# Altium project Baja_PDU.PrjPcb
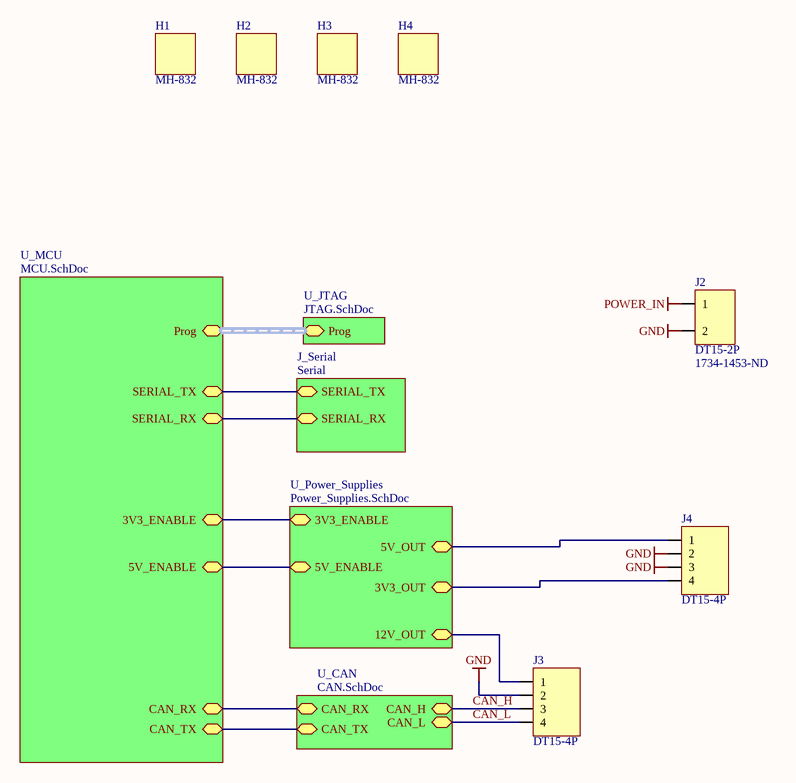
[diagram p0: Baja_PDU_004.SchDoc]
6 sheets, 96 parts. Net scope: hierarchical (ports join the sheet entries above them; power ports are global).
Board file: Baja_PDU_004.PcbDoc
Sheets:
  Baja_PDU_004.SchDoc
    U_JTAG = JTAG.SchDoc
    U_MCU = MCU.SchDoc
    U_Power_Supplies = Power_Supplies.SchDoc
    U_CAN = CAN.SchDoc
    J_Serial = Serial.SchDoc

## Sheet Baja_PDU_004.SchDoc
size Tabloid

### Parts
H1  MH-832  [MH-832]
H2  MH-832  [MH-832]
H3  MH-832  [MH-832]
H4  MH-832  [MH-832]
J2  DT15-2P  Supplier Part Number 1: 1734-1453-ND  [Connector-DT15-2P]
J3  DT15-4P  [DT15-4P]
J4  DT15-4P  [DT15-4P]

### Sub-sheets
J_Serial = Serial: SERIAL_RX, SERIAL_TX
U_CAN = CAN.SchDoc: CAN_H (bidir), CAN_L (bidir), CAN_RX (bidir), CAN_TX (bidir)
U_JTAG = JTAG.SchDoc: Prog (harness Prog)
U_MCU = MCU.SchDoc: Prog (harness Prog), CAN_TX (bidir), CAN_RX (bidir), 5V_ENABLE (bidir), SERIAL_TX, SERIAL_RX, 3V3_ENABLE
U_Power_Supplies = Power_Supplies.SchDoc: 5V_ENABLE (bidir), 3V3_ENABLE, 3V3_OUT, 5V_OUT, 12V_OUT

### Nets
GND: J2.2 J3.2 J4.2 J4.3
POWER_IN: J2.1
3V3-Enable: sheet U_MCU/3V3_ENABLE, sheet U_Power_Supplies/3V3_ENABLE
5V-ENABLE: sheet U_MCU/5V_ENABLE, sheet U_Power_Supplies/5V_ENABLE
CAN0RX: sheet U_MCU/CAN_RX, sheet U_CAN/CAN_RX
CAN0TX: sheet U_MCU/CAN_TX, sheet U_CAN/CAN_TX
CAN_H: J3.3 ; sheet U_CAN/CAN_H
CAN_L: J3.4 ; sheet U_CAN/CAN_L
Serial_RX: sheet U_MCU/SERIAL_RX, sheet J_Serial/SERIAL_RX
Serial_TX: sheet U_MCU/SERIAL_TX, sheet J_Serial/SERIAL_TX
NetF1_3: J4.4 ; sheet U_Power_Supplies/3V3_OUT
NetF2_3: J3.1 ; sheet U_Power_Supplies/12V_OUT
NetF3_3: J4.1 ; sheet U_Power_Supplies/5V_OUT

### Buses and harness runs
harness sheet U_JTAG/Prog = sheet U_MCU/Prog

### Library data of the parts
J2 = Connector-DT15-2P: Supplier 1: Digi-Key
J3 J4 = Connector-DT15-4P: Supplier 1: Digi-Key; Supplier Part Number 1: 1734-1030-ND
H1-H4 = MH-832: Supplier Part Number 1: 91251A190

## Sheet JTAG.SchDoc
size A
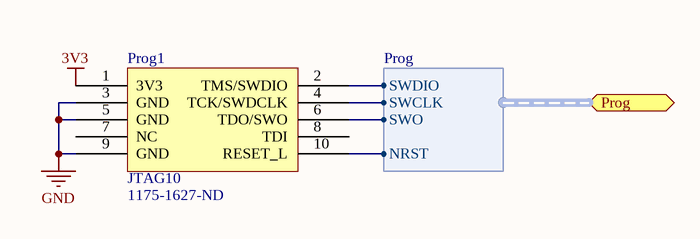
[diagram p1: JTAG.SchDoc]

### Parts
Prog1  JTAG10  Supplier Part Number 1: 1175-1627-ND  [JTAG10 Polarity]

### Ports
Prog (harness Prog)

### Harnesses
Prog: NRST, SWCLK, SWDIO, SWO

### Nets
3V3: Prog1.1(3V3)
GND: Prog1.3(GND) Prog1.5(GND) Prog1.9(GND)
NRST: Prog1.10(RESET_L) ; port Prog.NRST
SWCLK: Prog1.4(TCK/SWDCLK) ; port Prog.SWCLK
SWDIO: Prog1.2(TMS/SWDIO) ; port Prog.SWDIO
SWO: Prog1.6(TDO/SWO) ; port Prog.SWO

Not connected (* = marked no-connect by the designer): Prog1 7(NC) 8(TDI)

### Library data of the parts
Prog1 = JTAG10: 3220-10-0100-00; Supplier 1: Digi-Key

## Sheet MCU.SchDoc
size A
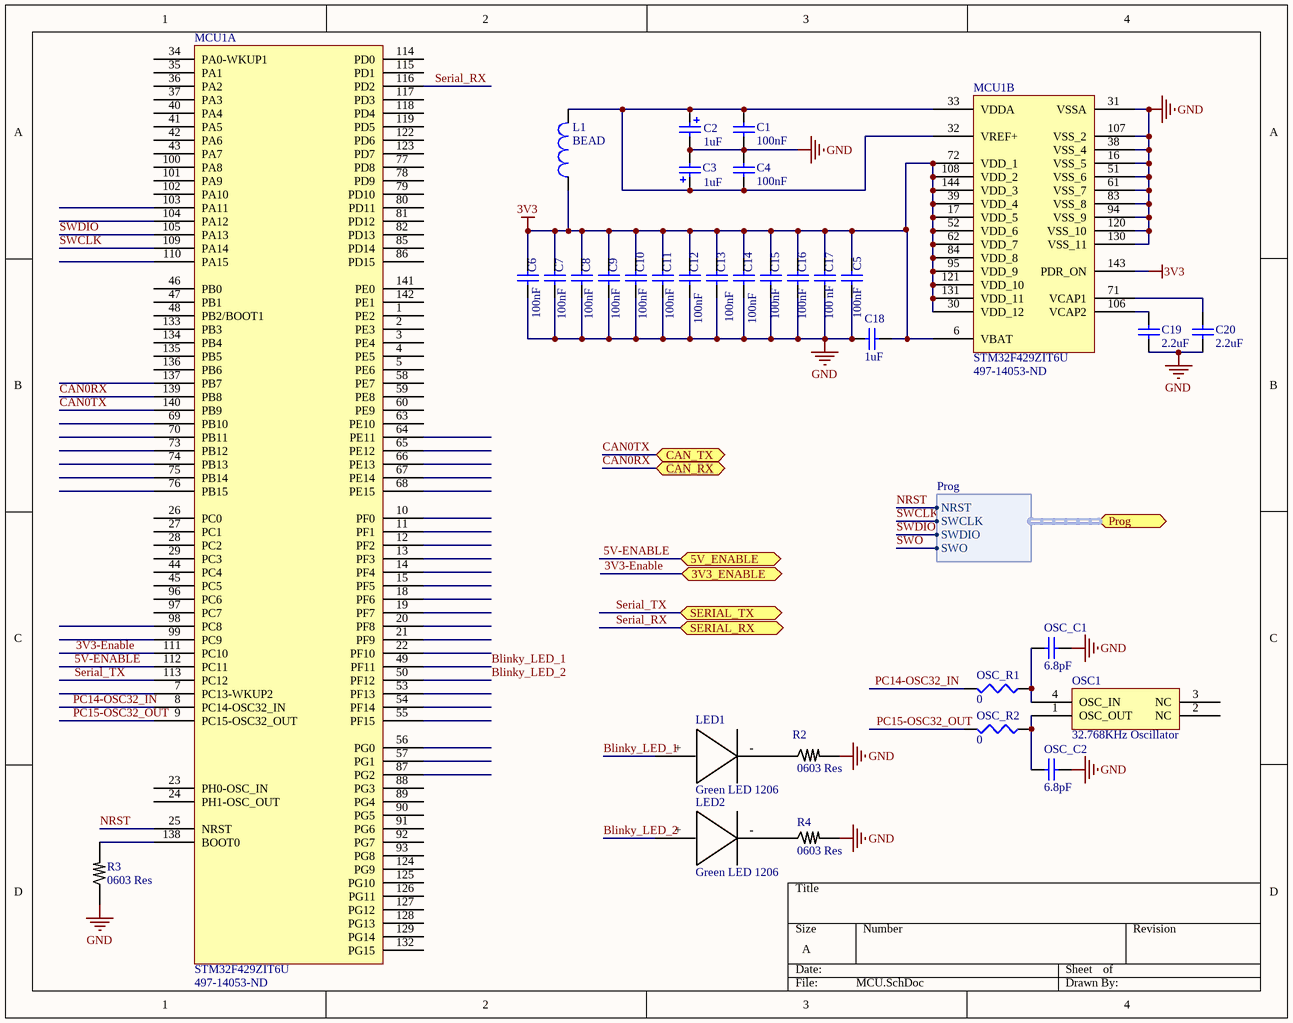
[diagram p2: MCU.SchDoc]

### Parts
C1  value 100nF  [SMD0603]  (hidden comment: Cap)
C2  value 1uF  [SMD1206 Polarized]  (hidden comment: Cap)
C3  value 1uF  [SMD1206 Polarized]  (hidden comment: Cap)
C4  value 100nF  [SMD0603]  (hidden comment: Cap)
C5  value 100nF  [SMD0603]  (hidden comment: Cap)
C6  value 100nF  [SMD0603]  (hidden comment: Cap)
C7  value 100nF  [SMD0603]  (hidden comment: Cap)
C8  value 100nF  [SMD0603]  (hidden comment: Cap)
C9  value 100nF  [SMD0603]  (hidden comment: Cap)
C10  value 100nF  [SMD0603]  (hidden comment: Cap)
C11  value 100nF  [SMD0603]  (hidden comment: Cap)
C12  value 100nF  [SMD0603]  (hidden comment: Cap)
C13  value 100nF  [SMD0603]  (hidden comment: Cap)
C14  value 100nF  [SMD0603]  (hidden comment: Cap)
C15  value 100nF  [SMD0603]  (hidden comment: Cap)
C16  value 100nF  [SMD0603]  (hidden comment: Cap)
C17  value 100 nF  [SMD0603]  (hidden comment: Cap)
C18  value 1uF  [SMD0603]  (hidden comment: Cap)
C19  value 2.2uF  [SMD1206]  (hidden comment: Cap)
C20  value 2.2uF  [SMD1206]  (hidden comment: Cap)
L1  BEAD  [SMD0603]
LED1  Green LED 1206  [Panel_Mount_LED]
LED2  Green LED 1206  [Panel_Mount_LED]
MCU1  STM32F429ZIT6U  Supplier Part Number 1: 497-14053-ND  [LQPF144]  (parts A,B of 2)
OSC1  32.768KHz Oscillator  [MC-306-OSC]
OSC_C1  value 6.8pF  [SMD0603]  (hidden comment: Cap)
OSC_C2  value 6.8pF  [SMD0603]  (hidden comment: Cap)
OSC_R1  value 0  [SMD0603]  (hidden comment: Res)
OSC_R2  value 0  [SMD0603]  (hidden comment: Res)
R2  0603 Res  [0603/1608 SMD Resistor]
R3  0603 Res  [0603/1608 SMD Resistor]
R4  0603 Res  [0603/1608 SMD Resistor]

### Ports
3V3_ENABLE (bidir), 5V_ENABLE (bidir), CAN_RX (bidir), CAN_TX (bidir), Prog (harness Prog), SERIAL_RX, SERIAL_TX

### Harnesses
Prog: NRST, SWCLK, SWDIO, SWO

### Nets
3V3: C5.1 C6.2 C7.2 C8.2 C9.2 C10.2 C11.2 C12.2 C13.2 C14.2 C15.2 C16.2 C17.2 C18.1 L1.1 MCU1.6(VBAT) MCU1.17(VDD_5) MCU1.30(VDD_12) MCU1.39(VDD_4) MCU1.52(VDD_6) MCU1.62(VDD_7) MCU1.72(VDD_1) MCU1.84(VDD_8) MCU1.95(VDD_9) MCU1.108(VDD_2) MCU1.121(VDD_10) MCU1.131(VDD_11) MCU1.143(PDR_ON) MCU1.144(VDD_3)
GND: C1.1 C2.2 C3.2 C4.2 C5.2 C6.1 C7.1 C8.1 C9.1 C10.1 C11.1 C12.1 C13.1 C14.1 C15.1 C16.1 C17.1 C18.2 C19.1 C20.1 MCU1.16(VSS_5) MCU1.31(VSSA) MCU1.38(VSS_4) MCU1.51(VSS_6) MCU1.61(VSS_7) MCU1.83(VSS_8) MCU1.94(VSS_9) MCU1.107(VSS_2) MCU1.120(VSS_10) MCU1.130(VSS_11) OSC_C1.1 OSC_C2.1 R2.2 R3.1 R4.2
3V3-Enable: MCU1.111(PC10) ; port 3V3_ENABLE
5V-ENABLE: MCU1.112(PC11) ; port 5V_ENABLE
Blinky_LED_1: LED1.+ MCU1.49(PF11)
Blinky_LED_2: LED2.+ MCU1.50(PF12)
CAN0RX: MCU1.139(PB8) ; port CAN_RX
CAN0TX: MCU1.140(PB9) ; port CAN_TX
NRST: MCU1.25(NRST) ; port Prog.NRST
PC14-OSC32_IN: MCU1.8(PC14-OSC32_IN) OSC_R1.2
PC15-OSC32_OUT: MCU1.9(PC15-OSC32_OUT) OSC_R2.2
Serial_RX: MCU1.116(PD2) ; port SERIAL_RX
Serial_TX: MCU1.113(PC12) ; port SERIAL_TX
SWCLK: MCU1.109(PA14) ; port Prog.SWCLK
SWDIO: MCU1.105(PA13) ; port Prog.SWDIO
NetC1_2: C1.2 C2.1 C3.1 C4.1 L1.2 MCU1.32(VREF+) MCU1.33(VDDA)
NetC19_2: C19.2 MCU1.106(VCAP2)
NetC20_2: C20.2 MCU1.71(VCAP1)
NetLED1_-: LED1.- R2.1
NetLED2_-: LED2.- R4.1
NetMCU1_138: MCU1.138(BOOT0) R3.2
NetOSC1_1: OSC1.1(OSC_OUT) OSC_C2.2 OSC_R2.1
NetOSC1_4: OSC1.4(OSC_IN) OSC_C1.2 OSC_R1.1

Not connected (* = marked no-connect by the designer): MCU1 1(PE2) 2(PE3) 3(PE4) 4(PE5) 5(PE6) 7(PC13-WKUP2) 10(PF0) 11(PF1) 12(PF2) 13(PF3) 14(PF4) 15(PF5) 18(PF6) 19(PF7) 20(PF8) 21(PF9) 22(PF10) 23(PH0-OSC_IN) 24(PH1-OSC_OUT) 26(PC0) 27(PC1) 28(PC2) 29(PC3) 34(PA0-WKUP1) 35(PA1) 36(PA2) 37(PA3) 40(PA4) 41(PA5) 42(PA6) 43(PA7) 44(PC4) 45(PC5) 46(PB0) 47(PB1) 48(PB2/BOOT1) 53(PF13) 54(PF14) 55(PF15) 56(PG0) 57(PG1) 58(PE7) 59(PE8) 60(PE9) 63(PE10) 64(PE11) 65(PE12) 66(PE13) 67(PE14) 68(PE15) 69(PB10) 70(PB11) 73(PB12) 74(PB13) 75(PB14) 76(PB15) 77(PD8) 78(PD9) 79(PD10) 80(PD11) 81(PD12) 82(PD13) 85(PD14) 86(PD15) 87(PG2) 88(PG3) 89(PG4) 90(PG5) 91(PG6) 92(PG7) 93(PG8) 96(PC6) 97(PC7) 98(PC8) 99(PC9) 100(PA8) 101(PA9) 102(PA10) 103(PA11) 104(PA12) 110(PA15) 114(PD0) 115(PD1) 117(PD3) 118(PD4) 119(PD5) 122(PD6) 123(PD7) 124(PG9) 125(PG10) 126(PG11) 127(PG12) 128(PG13) 129(PG14) 132(PG15) 133(PB3) 134(PB4) 135(PB5) 136(PB6) 137(PB7) 141(PE0) 142(PE1); OSC1 2(NC) 3(NC)

### Library data of the parts
C1 C4-C20 OSC_C1 OSC_C2 = Capacitor Ceramic: Ceramic Chip Capacitor
C2 C3 = Capacitor Polarized: Polarized Capacitor (Surface Mount)
L1 = Chip Ferrite Bead: Ferrite Bead; Part: BK1608HS601-TV
LED1 LED2 = 1206 Green LED: Green surface mount LED
OSC1 = MC-306 32.768K-E3: 32.7680kHz Oscillator
OSC_R1 OSC_R2 = Resistor
MCU1 = STM32F429ZIT6U: Supplier 1: Digi-Key

## Sheet Power_Supplies.SchDoc
size B
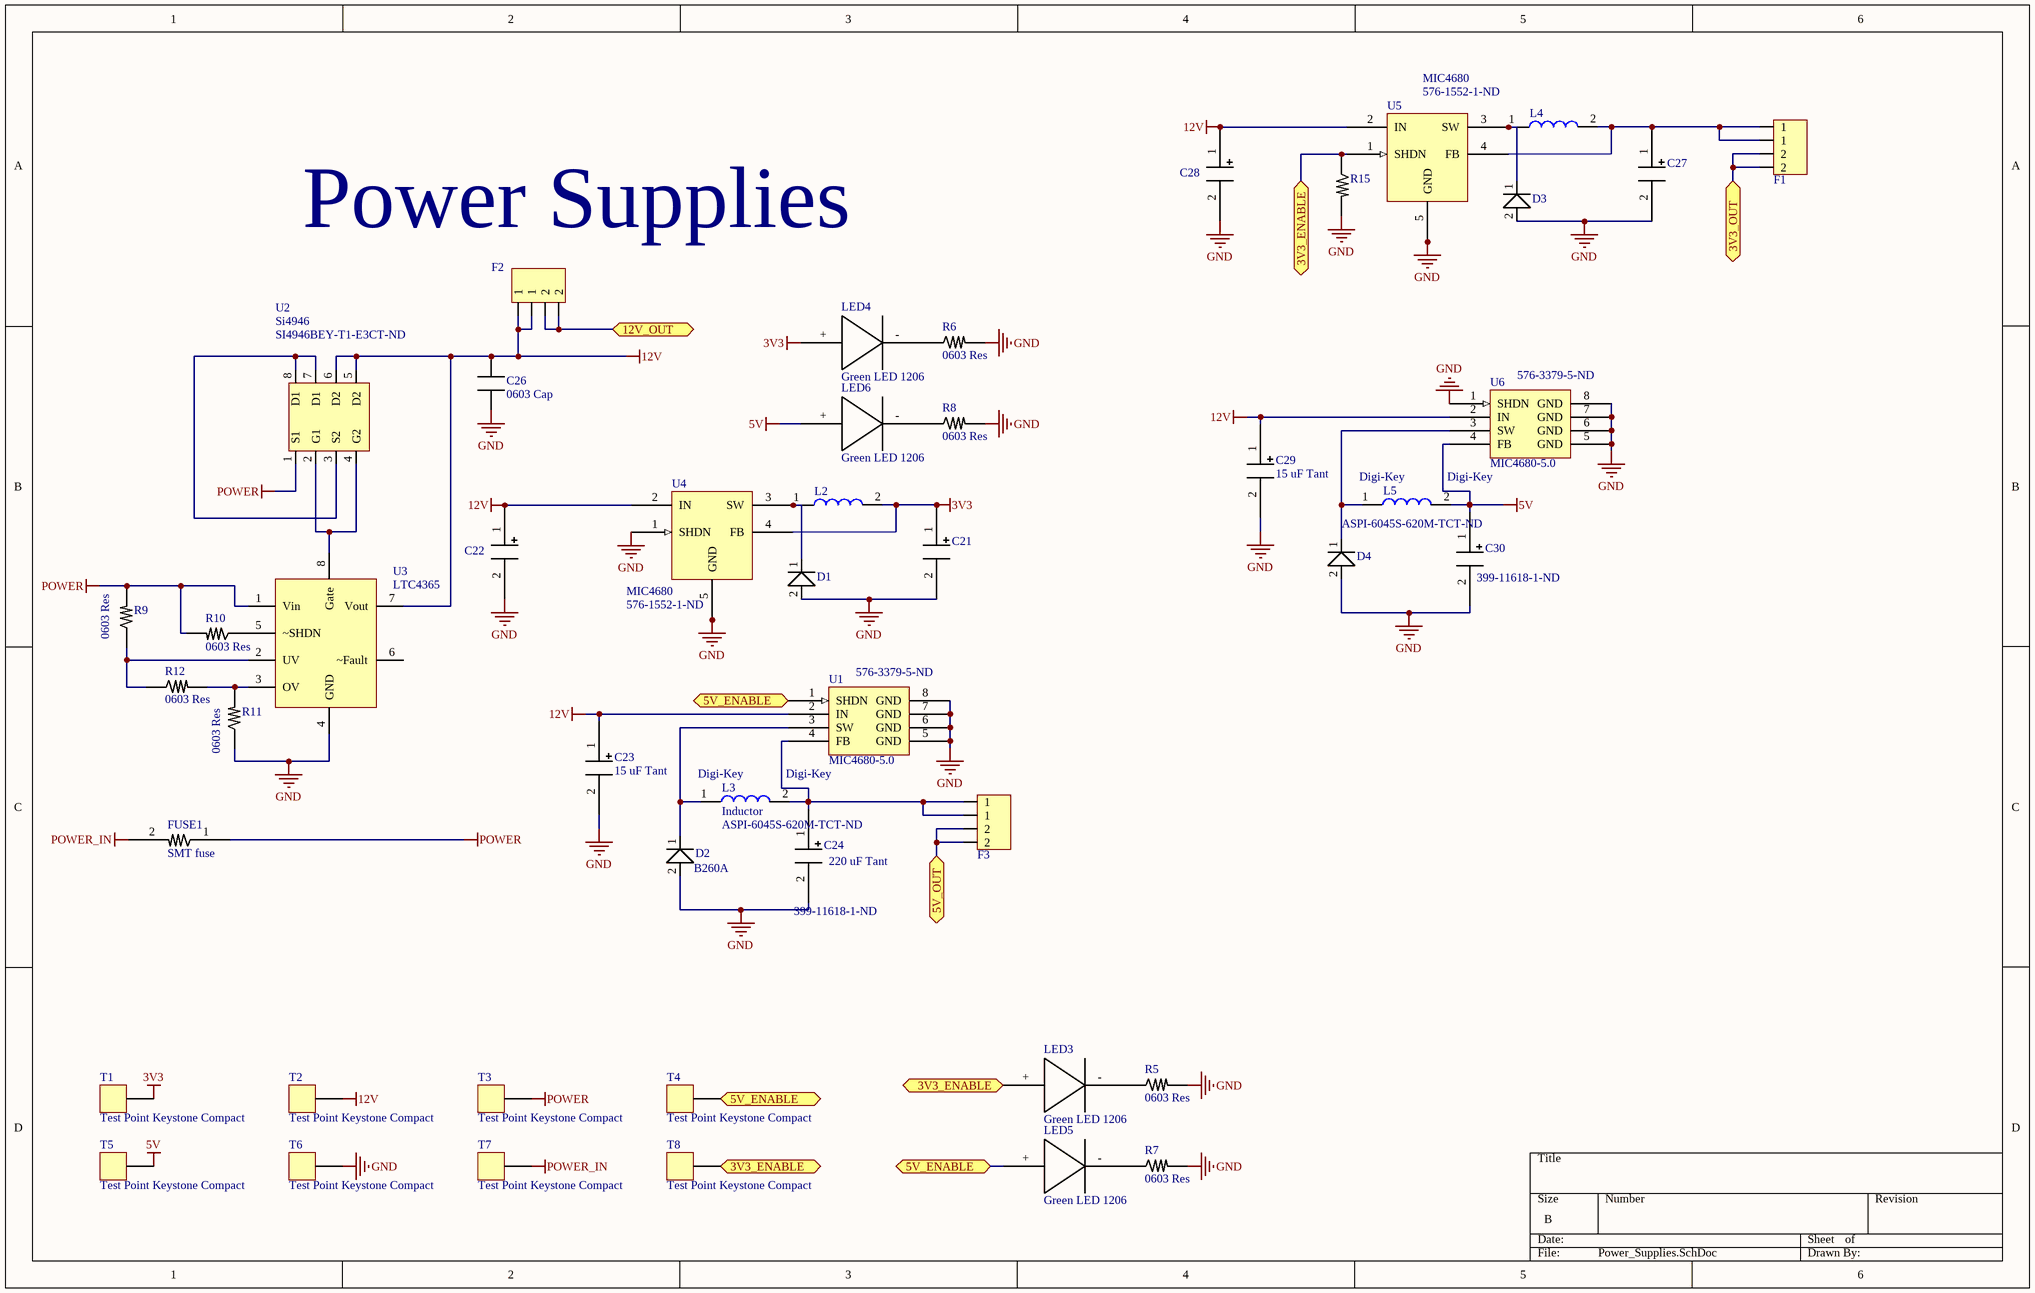
[diagram p3: Power_Supplies.SchDoc]

### Parts
C21  220 uF Tantalum Capacitor  [2312 Surface Mount (POLAR)]  (value not drawn)
C22  15 uF Tantalum Capacitor  [1206 (POLAR)]  (value not drawn)
C23  15 uF Tant  [1206 (POLAR)]
C24  220 uF Tant  Supplier Part Number 1: 399-11618-1-ND  [2312 Surface Mount (POLAR)]
C26  0603 Cap  [0603/1608 SMD Resistor]
C27  220 uF Tantalum Capacitor  [2312 Surface Mount (POLAR)]  (value not drawn)
C28  15 uF Tantalum Capacitor  [1206 (POLAR)]  (value not drawn)
C29  15 uF Tant  [1206 (POLAR)]
C30  Supplier Part Number 1: 399-11618-1-ND  [2312 Surface Mount (POLAR)]  (hidden comment: 220 uF Tant)
D1  B260A Flyback Diode  [DO-214AC]  (value not drawn)
D2  B260A  [DO-214AC]
D3  B260A Flyback Diode  [DO-214AC]  (value not drawn)
D4  B260A  [DO-214AC]  (value not drawn)
F1  Keystone Fuseholder  [Keystone Fuseholder 3568]  (value not drawn)
F2  Keystone Fuseholder  [Keystone Fuseholder 3568]  (value not drawn)
F3  Keystone Fuseholder  [Keystone Fuseholder 3568]  (value not drawn)
FUSE1  SMT fuse  [1206]
L2  ASPI-6045S  [ASPI-6045]  (value not drawn)
L3  Inductor  Supplier 1: Digi-Key  Supplier Part Number 1: ASPI-6045S-620M-TCT-ND  [ASPI-6045]
L4  ASPI-6045S  [ASPI-6045]  (value not drawn)
L5  Supplier 1: Digi-Key  Supplier Part Number 1: ASPI-6045S-620M-TCT-ND  [ASPI-6045]  (hidden comment: Inductor)
LED3  Green LED 1206  [Panel_Mount_LED]
LED4  Green LED 1206  [Panel_Mount_LED]
LED5  Green LED 1206  [Cathode Mark 1206 led footprint]
LED6  Green LED 1206  [Cathode Mark 1206 led footprint]
R5  0603 Res  [0603/1608 SMD Resistor]
R6  0603 Res  [0603/1608 SMD Resistor]
R7  0603 Res  [0603/1608 SMD Resistor]
R8  0603 Res  [0603/1608 SMD Resistor]
R9  0603 Res  [0603/1608 SMD Resistor]
R10  0603 Res  [0603/1608 SMD Resistor]
R11  0603 Res  [0603/1608 SMD Resistor]
R12  0603 Res  [0603/1608 SMD Resistor]
R15  0603 Res  [0603/1608 SMD Resistor]  (value not drawn)
T1  Test Point Keystone Compact  [Keystone Test Point Compact]
T2  Test Point Keystone Compact  [Keystone Test Point Compact]
T3  Test Point Keystone Compact  [Keystone Test Point Compact]
T4  Test Point Keystone Compact  [Keystone Test Point Compact]
T5  Test Point Keystone Compact  [Keystone Test Point Compact]
T6  Test Point Keystone Compact  [Keystone Test Point Compact]
T7  Test Point Keystone Compact  [Keystone Test Point Compact]
T8  Test Point Keystone Compact  [Keystone Test Point Compact]
U1  MIC4680-5.0  Supplier 1: Digi-Key  Supplier Part Number 1: 576-3379-5-ND  [SOIC8]
U2  Si4946  Supplier Part Number 1: SI4946BEY-T1-E3CT-ND  [S0-8]
U3  LTC4365  [TS8]
U4  MIC4680  Supplier Part Number 1: 576-1552-1-ND  [TJA1040]
U5  MIC4680  Supplier Part Number 1: 576-1552-1-ND  [TJA1040]
U6  MIC4680-5.0  Supplier 1: Digi-Key  Supplier Part Number 1: 576-3379-5-ND  [SOIC8]

### Ports
3V3_ENABLE, 3V3_ENABLE (bidir), 3V3_OUT, 5V_ENABLE (bidir), 5V_OUT, 12V_OUT

### Nets
3V3: C21.1 L2.2 LED4.+ T1.1 U4.4(FB)
5V: C30.1 L5.2 LED6.+ T5.1 U6.4(FB)
12V: C22.1 C23.1 C26.2 C28.1 C29.1 F2.1 F2.2(1) T2.1 U1.2(IN) U2.5(D2) U2.6(D2) U3.7(Vout) U4.2(IN) U5.2(IN) U6.2(IN)
GND: C21.2 C22.2 C23.2 C24.2 C26.1 C27.2 C28.2 C29.2 C30.2 D1.2 D2.2 D3.2 D4.2 R5.2 R6.2 R7.2 R8.2 R11.1 R15.2 T6.1 U1.5(GND) U1.6(GND) U1.7(GND) U1.8(GND) U3.4(GND) U4.1(SHDN) U4.5(GND) U4.6 U4.7 U4.8 U5.5(GND) U5.6 U5.7 U5.8 U6.1(SHDN) U6.5(GND) U6.6(GND) U6.7(GND) U6.8(GND)
POWER: FUSE1.1 R9.2 R10.2 T3.1 U2.1(S1) U3.1(Vin)
POWER_IN: FUSE1.2 T7.1
3V3-Enable: LED3.+ R15.1 T8.1 U5.1(SHDN) ; port 3V3_ENABLE
5V-ENABLE: LED5.+ T4.1 U1.1(SHDN) ; port 5V_ENABLE
NetC24_1: C24.1 F3.1 F3.2(1) L3.2 U1.4(FB)
NetC27_1: C27.1 F1.1 F1.2(1) L4.2 U5.4(FB)
NetD1_1: D1.1 L2.1 U4.3(SW)
NetD2_1: D2.1 L3.1 U1.3(SW)
NetD3_1: D3.1 L4.1 U5.3(SW)
NetD4_1: D4.1 L5.1 U6.3(SW)
NetF1_3: F1.3(2) F1.4(2) ; port 3V3_OUT
NetF2_3: F2.3(2) F2.4(2) ; port 12V_OUT
NetF3_3: F3.3(2) F3.4(2) ; port 5V_OUT
NetLED3_-: LED3.- R5.1
NetLED4_-: LED4.- R6.1
NetLED5_-: LED5.- R7.1
NetLED6_-: LED6.- R8.1
NetR9_1: R9.1 R12.1 U3.2(UV)
NetR10_1: R10.1 U3.5(~SHDN)
NetR11_2: R11.2 R12.2 U3.3(OV)
NetU2_2: U2.2(G1) U2.4(G2) U3.8(Gate)
NetU2_3: U2.3(S2) U2.7(D1) U2.8(D1)

Not connected (* = marked no-connect by the designer): U3 6(~Fault)

### Notes on the sheet
- Power Supplies

### Library data of the parts
C21 C24 C27 C30 = 220 uF Tantalum Capacitor: 2312 Surface Mount Capacitor
  C24 C30: Supplier 1: Digi-Key
C22 C23 C28 C29 = 15 uF Tantalum Capacitor: 1206 Surface Mount Capacitor
C26 = 0603 Cap: 100 uF electrolytic cap
D2 D4 = B260A Flyback Diode
FUSE1 = 0 Resistor Surface mount 1206: 0 ohm surface mount resistor.; ComponentLink1URL: http://industrial.panasonic.com/www-cgi/jvcr13pz.cgi?E+PZ+3+AOA0001+ERJ8GEYJ103V+7+WW; ComponentLink1Description: Datasheet for 10k Resistor
L2 L4 = ASPI-6045S: 68 uH 1.2A surface mount inductor
LED3-LED6 = 1206 Green LED: Green surface mount LED
R9 = 0603 Res: 6.04 MOhm Res
R10 = 0603 Res: 100 kOhm SMD Res
R11 = 0603 Res: 210 kOhm Res
R15 = 0603 Res: Pull Down, 1kOhm
U1 U6 = MIC4680-5.0: 5V Fixed Switching Regulator 1A
U4 U5 = MIC4680: 3.3V Fixed Switching Regulator 1A; Supplier 1: Digi-Key
F1-F3 = Keystone Fuseholder: Supplier 1: Digi-Key; Supplier Part Number 1: 36-3568-ND
L3 L5 = Inductor: Supplier 2: Digi-Key; Supplier 3: Digi-Key; Supplier Part Number 2: 308-1571-1-ND; Supplier Part Number 3: SRP7030-4R7FMCT-ND
T1-T8 = Test Point Keystone Compact: Supplier 1: Digi-Key; Supplier Part Number 1: 36-5006-ND
U2 = Si4946: Supplier 1: Digi-Key

## Sheet CAN.SchDoc
size A
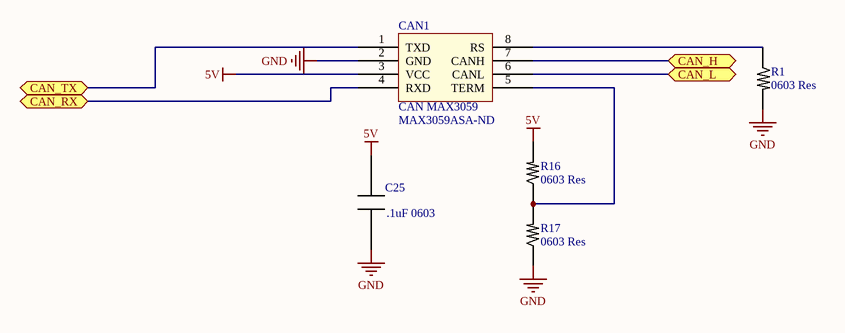
[diagram p4: CAN.SchDoc]

### Parts
C25  .1uF 0603  [0603/1608 SMD Resistor]
CAN1  CAN MAX3059  Supplier Part Number 1: MAX3059ASA-ND  [TJA1040]
R1  0603 Res  [0603/1608 SMD Resistor]
R16  0603 Res  [0603/1608 SMD Resistor]
R17  0603 Res  [0603/1608 SMD Resistor]

### Ports
CAN_H (bidir), CAN_L (bidir), CAN_RX (bidir), CAN_TX (bidir)

### Nets
5V: C25.2 CAN1.3(VCC) R16.2
GND: C25.1 CAN1.2(GND) R1.2 R17.1
CAN0RX: CAN1.4(RXD) ; port CAN_RX
CAN0TX: CAN1.1(TXD) ; port CAN_TX
CAN_H: CAN1.7(CANH) ; port CAN_H
CAN_L: CAN1.6(CANL) ; port CAN_L
NetCAN1_5: CAN1.5(TERM) R16.1 R17.2
NetCAN1_8: CAN1.8(RS) R1.1

### Library data of the parts
C25 = 0603 Cap
CAN1 = CAN MAX3059: Supplier 1: Digi-Key

## Sheet Serial.SchDoc
size A
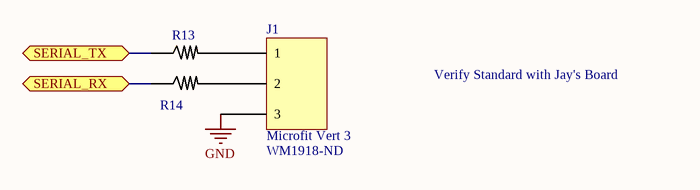
[diagram p5: Serial.SchDoc]

### Parts
J1  Microfit Vert 3  Supplier Part Number 1: WM1918-ND  [MICRO-FIT 3 POS VERT THROUGH HOLE]
R13  0603 Res  [0603/1608 SMD Resistor]  (value not drawn)
R14  0603 Res  [0603/1608 SMD Resistor]  (value not drawn)

### Ports
SERIAL_RX, SERIAL_TX

### Nets
GND: J1.3
Serial_RX: R14.1 ; port SERIAL_RX
Serial_TX: R13.1 ; port SERIAL_TX
NetJ1_1: J1.1 R13.2
NetJ1_2: J1.2 R14.2

### Notes on the sheet
- Verify Standard with Jay's Board

### Library data of the parts
J1 = Micro-fit 3 Pos Vertical Through Hole: Supplier 1: Digi-Key
R13 R14 = 0603 Res: 220 Ohm Res

## Nets that join several sheets
3V3: JTAG (Prog1.1), MCU (29 pins), Power_Supplies (5 pins)
5V: Power_Supplies (5 pins), CAN (C25.2 CAN1.3 R16.2)
GND: Baja_PDU_004 (J2.2 J3.2 J4.2 J4.3), JTAG (Prog1.3 Prog1.5 Prog1.9), MCU (35 pins), Power_Supplies (39 pins), CAN (C25.1 CAN1.2 R1.2 R17.1), Serial (J1.3)
POWER_IN: Baja_PDU_004 (J2.1), Power_Supplies (FUSE1.2 T7.1)
3V3-Enable: MCU (MCU1.111), Power_Supplies (LED3.+ R15.1 T8.1 U5.1)
5V-ENABLE: MCU (MCU1.112), Power_Supplies (LED5.+ T4.1 U1.1)
CAN0RX: MCU (MCU1.139), CAN (CAN1.4)
CAN0TX: MCU (MCU1.140), CAN (CAN1.1)
CAN_H: Baja_PDU_004 (J3.3), CAN (CAN1.7)
CAN_L: Baja_PDU_004 (J3.4), CAN (CAN1.6)
NetF1_3: Baja_PDU_004 (J4.4), Power_Supplies (F1.3 F1.4)
NetF2_3: Baja_PDU_004 (J3.1), Power_Supplies (F2.3 F2.4)
NetF3_3: Baja_PDU_004 (J4.1), Power_Supplies (F3.3 F3.4)
NRST: JTAG (Prog1.10), MCU (MCU1.25)
Serial_RX: MCU (MCU1.116), Serial (R14.1)
Serial_TX: MCU (MCU1.113), Serial (R13.1)
SWCLK: JTAG (Prog1.4), MCU (MCU1.109)
SWDIO: JTAG (Prog1.2), MCU (MCU1.105)